# Altium schematic sheet Core.SchDoc
size Legal; SheetNumber: 1; SheetTotal: 3
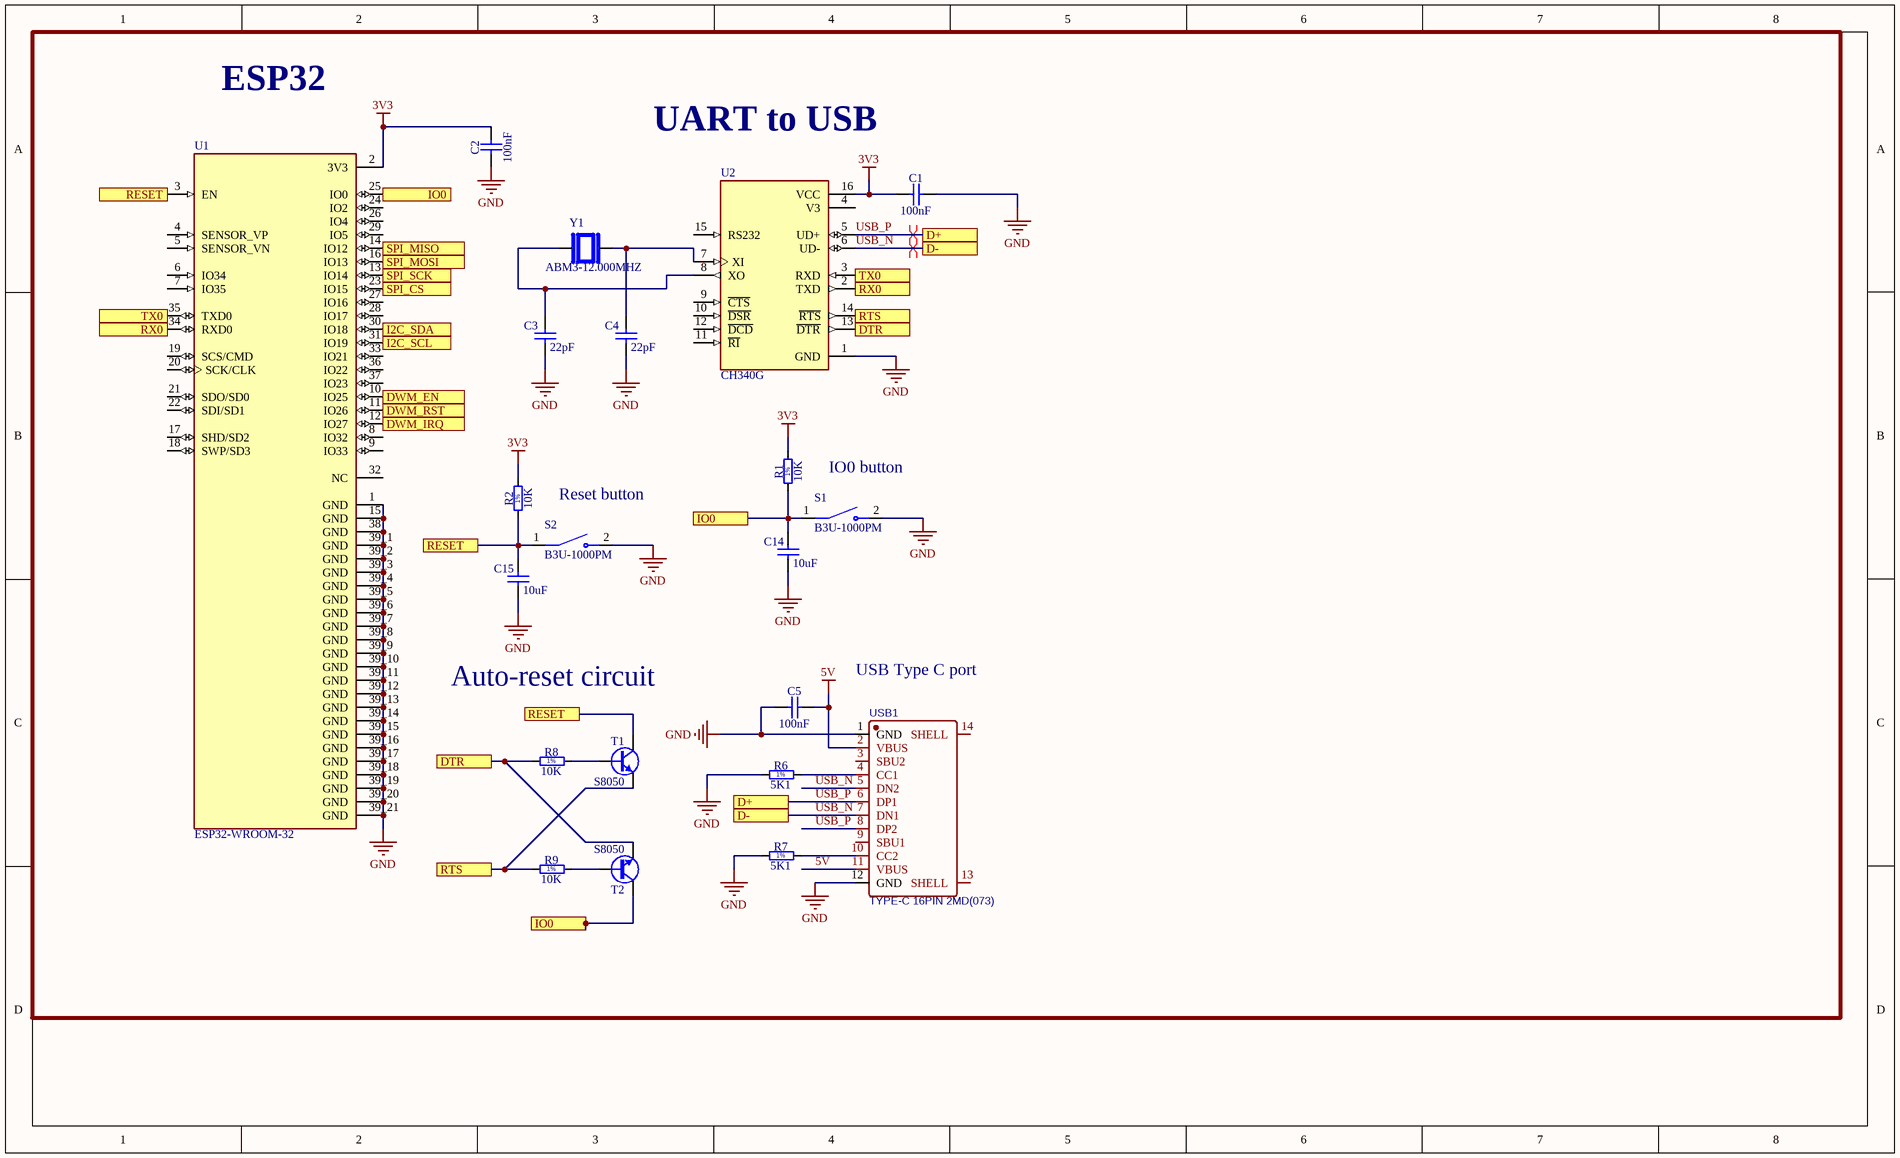
[diagram p0: Core.SchDoc]

## Parts
C1  100nF  [0603C]
C2  100nF  [0603C]
C3  22pF  [0603C]
C4  22pF  [0603C]
C5  100nF  [0603C]
C14  10uF  [0603C]
C15  10uF  [0603C]
R1  10K  [0603R]
R2  10K  [0603R]
R6  5K1  [0603R]
R7  5K1  [0603R]
R8  10K  [0603R]
R9  10K  [0603R]
S1  B3U-1000PM  [SW_B3U-1000PM]
S2  B3U-1000PM  [SW_B3U-1000PM]
T1  S8050  [SOT-23-3]
T2  S8050  [SOT-23-3]
U1  ESP32-WROOM-32  [MODULE_ESP32-WROOM-32]
U2  CH340G  [SOIC127P600X180-16N]
USB1  TYPE-C 16PIN 2MD(073)  [USB-C-SMD_TYPE-C-6PIN-2MD-073]
Y1  ABM3-12.000MHZ  [XTAL_ABM3-8.000MHZ-D2Y-T]

## Ports
D+, D-, DTR, DWM_EN, DWM_IRQ, DWM_RST, I2C_SCL, I2C_SDA, IO0, RESET, RTS, RX0, SPI_CS, SPI_MISO, SPI_MOSI, SPI_SCK, TX0

## Nets
3V3: C1.1 C2.2 R1.2 R2.2 U1.2(3V3) U2.16(VCC)
5V: C5.2 USB1.2(VBUS) USB1.11(VBUS)
GND: C1.2 C2.1 C3.1 C4.1 C5.1 C14.1 C15.1 R6.1 R7.1 S1.2 S2.2 U1.1(GND) U1.15(GND) U1.38(GND) U1.39_1(GND) U1.39_2(GND) U1.39_3(GND) U1.39_4(GND) U1.39_5(GND) U1.39_6(GND) U1.39_7(GND) U1.39_8(GND) U1.39_9(GND) U1.39_10(GND) U1.39_11(GND) U1.39_12(GND) U1.39_13(GND) U1.39_14(GND) U1.39_15(GND) U1.39_16(GND) U1.39_17(GND) U1.39_18(GND) U1.39_19(GND) U1.39_20(GND) U1.39_21(GND) U2.1(GND) USB1.1(GND) USB1.12(GND)
DTR: R8.1 T2.2(E) U2.13(~{DTR}) ; port DTR
DWM_EN: U1.10(IO25) ; port DWM_EN
DWM_IRQ: U1.12(IO27) ; port DWM_IRQ
DWM_RST: U1.11(IO26) ; port DWM_RST
I2C_SCL: U1.31(IO19) ; port I2C_SCL
I2C_SDA: U1.30(IO18) ; port I2C_SDA
IO0: C14.2 R1.1 S1.1 T2.3(C) U1.25(IO0) ; port IO0
RESET: C15.2 R2.1 S2.1 T1.3(C) U1.3(EN) ; port RESET
RTS: R9.1 T1.2(E) U2.14(~{RTS}) ; port RTS
RX0: U1.34(RXD0) U2.2(TXD) ; port RX0
SPI_CS: U1.23(IO15) ; port SPI_CS
SPI_MISO: U1.14(IO12) ; port SPI_MISO
SPI_MOSI: U1.16(IO13) ; port SPI_MOSI
SPI_SCK: U1.13(IO14) ; port SPI_SCK
TX0: U1.35(TXD0) U2.3(RXD) ; port TX0
USB_N: U2.6(UD-) USB1.5(DN2) USB1.7(DN1) ; port D-
USB_P: U2.5(UD+) USB1.6(DP1) USB1.8(DP2) ; port D+
NetC3_2: C3.2 U2.8(XO) Y1.1
NetC4_2: C4.2 U2.7(XI) Y1.2
NetR6_2: R6.2 USB1.4(CC1)
NetR7_2: R7.2 USB1.10(CC2)
NetR8_2: R8.2 T1.1(B)
NetR9_2: R9.2 T2.1(B)

Not connected (* = marked no-connect by the designer): U1 4(SENSOR_VP) 5(SENSOR_VN) 6(IO34) 7(IO35) 8(IO32) 9(IO33) 17(SHD/SD2) 18(SWP/SD3) 19(SCS/CMD) 20(SCK/CLK) 21(SDO/SD0) 22(SDI/SD1) 24(IO2) 26(IO4) 27(IO16) 28(IO17) 29(IO5) 32(NC) 33(IO21) 36(IO22) 37(IO23); U2 4(V3) 9(~{CTS}) 10(~{DSR}) 11(~{RI}) 12(~{DCD}) 15(RS232); USB1 3(SBU2) 9(SBU1) 13(SHELL) 14(SHELL)

## Layout directives
differential pair: USB_N, USB_P

## Notes on the sheet
- ESP32
- UART to USB
- Reset button
- IO0 button
- Auto-reset circuit
- USB Type C port
- (in symbol Resistor - 1%_1) 1%

## Library data of the parts
C1 C2 C5 = Capacitor - non polarized: Non-polarised capacitor
C3 C4 C14 C15 = Capacitor - non polarized_1: Non-polarised capacitor
R1 R2 R6-R9 = Resistor - 1%_1: Resistor - 1%
S1 S2 = B3U-1000PM: Top, w/o Boss 1k Reel | Omron Electronic Components B3U-1000PM; SnapEDA_Link: https://www.snapeda.com/parts/B3U-1000PM/Omron/view-part/?ref=snap; Package: Custom Package Omron; Value: *; MF: Omron; MP: B3U-1000PM; Check_prices: https://www.snapeda.com/parts/B3U-1000PM/Omron/view-part/?ref=eda
T1 T2 = NPN B1 E2 C3: NPN Transistor
U1 = ESP32-WROOM-32: Bluetooth, WiFi 802.11b/g/n, Bluetooth v4.2 +EDR, Class 1, 2 and 3 Transceiver Module 2.4GHz ~ 2.5GHz Antenna Not Included, U.FL Surface Mount; MF: Espressif Systems; Price: None; Availability: In Stock; MP: ESP32-WROOM-32; Package: Module Espressif Systems; SnapEDA_Link: https://www.snapeda.com/parts/ESP32-WROOM-32/Espressif+Systems/view-part/?ref=snap; Check_prices: https://www.snapeda.com/parts/ESP32-WROOM-32/Espressif+Systems/view-part/?ref=eda; Value: *; Purchase-URL: https://pricing.snapeda.com/search/part/ESP32-WROOM-32/?ref=eda
U2 = CH340G: USB Interface Integrated Circuit; MF: WCH; Value: *; SnapEDA_Link: https://www.snapeda.com/parts/Ch340G/WCH/view-part/?ref=snap; MP: Ch340G; Check_prices: https://www.snapeda.com/parts/Ch340G/WCH/view-part/?ref=eda; Availability: Not in stock; Price: None; Package: None
USB1 = TYPE-C 16PIN 2MD(073): Manufacturer: SHOU HAN(首韩); Contributor: LCSC; Supplier: LCSC; Supplier Part: C2765186; Manufacturer Part: TYPE-C 16PIN 2MD(073); JLCPCB Part Class: Extended Part; spicePre: U; spiceSymbolName: TYPE-C 16PIN 2MD(073)
Y1 = ABM3-8.000MHZ-D2Y-T: 8 MHz Â±20ppm Crystal 18pF 140 Ohms 2-SMD, No Lead; MF: Abracon; Purchase-URL: https://pricing.snapeda.com/search/part/ABM3-8.000MHZ-D2Y-T/?ref=eda; MP: ABM3-8.000MHZ-D2Y-T; SnapEDA_Link: https://www.snapeda.com/parts/ABM3-8.000MHZ-D2Y-T/Abracon+LLC/view-part/?ref=snap; Value: *; Package: SMD-2 Abracon; Price: None; Availability: In Stock; Check_prices: https://www.snapeda.com/parts/ABM3-8.000MHZ-D2Y-T/Abracon+LLC/view-part/?ref=eda